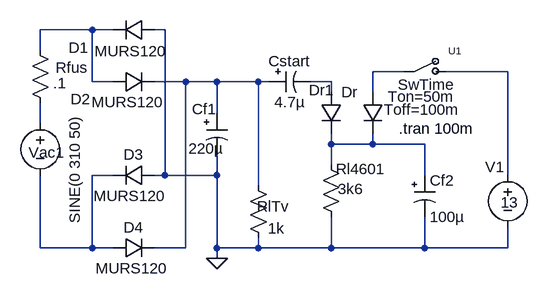
[diagram p0: schematic tda4601_Cstart.asc]
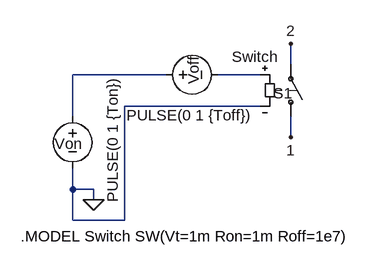
[diagram p1: sub-circuit swtime.asc]
tda4601_Cstart.asc, the LTspice schematic file:
Version 4
SHEET 1 880 680
WIRE -896 -48 -976 -48
WIRE -864 -48 -896 -48
WIRE -784 -48 -800 -48
WIRE -976 -16 -976 -48
WIRE -416 16 -464 16
WIRE -256 16 -352 16
WIRE -896 32 -896 -48
WIRE -864 32 -896 32
WIRE -752 32 -800 32
WIRE -704 32 -752 32
WIRE -640 32 -704 32
WIRE -624 32 -640 32
WIRE -528 32 -560 32
WIRE -528 48 -528 32
WIRE -464 48 -464 16
WIRE -704 80 -704 32
WIRE -976 96 -976 64
WIRE -528 128 -528 112
WIRE -464 128 -464 112
WIRE -464 128 -528 128
WIRE -384 128 -464 128
WIRE -528 160 -528 128
WIRE -864 176 -896 176
WIRE -784 176 -784 -48
WIRE -784 176 -800 176
WIRE -704 176 -704 144
WIRE -704 176 -784 176
WIRE -384 176 -384 128
WIRE -256 176 -256 16
WIRE -640 192 -640 32
WIRE -976 288 -976 176
WIRE -896 288 -896 176
WIRE -896 288 -976 288
WIRE -864 288 -896 288
WIRE -752 288 -752 32
WIRE -752 288 -800 288
WIRE -704 288 -704 176
WIRE -640 288 -640 272
WIRE -640 288 -704 288
WIRE -528 288 -528 240
WIRE -528 288 -640 288
WIRE -384 288 -384 240
WIRE -384 288 -528 288
WIRE -256 288 -256 256
WIRE -256 288 -384 288
WIRE -704 304 -704 288
FLAG -704 304 0
SYMBOL diode -800 -64 R90
WINDOW 0 59 117 VBottom 0
WINDOW 3 33 37 VTop 0
SYMATTR InstName D1
SYMATTR Value MURS120
SYMBOL diode -864 16 M90
WINDOW 0 58 -50 VBottom 0
WINDOW 3 32 23 VTop 0
SYMATTR InstName D2
SYMATTR Value MURS120
SYMBOL diode -800 160 R90
WINDOW 0 0 32 VBottom 0
WINDOW 3 32 38 VTop 0
SYMATTR InstName D3
SYMATTR Value MURS120
SYMBOL diode -864 272 M90
WINDOW 0 0 32 VBottom 0
WINDOW 3 32 29 VTop 0
SYMATTR InstName D4
SYMATTR Value MURS120
SYMBOL voltage -976 80 R0
WINDOW 0 -18 61 Left 0
WINDOW 3 53 4 VRight 0
WINDOW 123 0 0 Left 0
WINDOW 39 24 132 Left 0
SYMATTR InstName Vac1
SYMATTR Value SINE(0 310 50)
SYMBOL res -992 -32 R0
WINDOW 0 40 42 Left 0
WINDOW 3 36 66 Left 0
SYMATTR InstName Rfus
SYMATTR Value .1
SYMATTR SpiceLine tol=1 pwr=0.1
SYMBOL polcap -720 80 R0
WINDOW 3 -28 55 Left 0
WINDOW 0 -22 -6 Left 0
SYMATTR Value 220µ
SYMATTR InstName Cf1
SYMATTR Description Capacitor
SYMATTR Type cap
SYMATTR SpiceLine V=100 Irms=590m Rser=0.1 MTBF=2000 Lser=0 mfg="Nichicon" pn="UPR2A221MRH" type="Al electrolytic" ppPkg=1
SYMBOL res -512 256 R180
WINDOW 0 -68 90 Left 0
WINDOW 3 -33 59 Left 0
SYMATTR InstName Rl4601
SYMATTR Value 3k6
SYMATTR SpiceLine tol=10 pwr=4
SYMBOL diode -480 48 R0
WINDOW 0 -32 0 Left 0
WINDOW 3 -108 57 Invisible 0
SYMATTR InstName Dr
SYMATTR Value MURS120
SYMBOL polcap -400 176 R0
WINDOW 3 24 64 Left 0
SYMATTR Value 100µ
SYMATTR InstName Cf2
SYMATTR Description Capacitor
SYMATTR Type cap
SYMATTR SpiceLine V=16 Irms=1.436 Rser=0.08 Lser=0 mfg="KEMET" pn="T495X107K016AS4823" type="Tantalum"
SYMBOL Robertugo\\SwTime -384 16 R0
SYMATTR SpiceLine Ton=50m
SYMATTR SpiceLine2 Toff=100m
SYMATTR InstName U1
SYMBOL voltage -256 160 R0
WINDOW 0 -35 3 Left 0
WINDOW 3 -11 58 Left 0
SYMATTR InstName V1
SYMATTR Value 13
SYMBOL polcap -624 16 M90
WINDOW 0 0 32 VBottom 0
WINDOW 3 32 32 VTop 0
SYMATTR InstName Cstart
SYMATTR Value 4.7µ
SYMATTR Description Capacitor
SYMATTR Type cap
SYMATTR SpiceLine V=100 Irms=37m Rser=4.6 Lser=0 mfg="Nichicon" pn="UPR2A4R7MAH" type="Al electrolytic"
SYMBOL res -624 288 R180
WINDOW 0 -31 64 Left 0
WINDOW 3 -24 30 Left 0
SYMATTR InstName RlTv
SYMATTR Value 1k
SYMATTR SpiceLine tol=10 pwr=4
SYMBOL diode -544 48 R0
WINDOW 0 -18 -3 Left 0
WINDOW 3 -108 57 Invisible 0
SYMATTR InstName Dr1
SYMATTR Value MURS120
TEXT -424 104 Left 0 !.tran 100m

swtime.asc, the sub-circuit schematic file:
Version 4
SHEET 1 880 1444
WIRE 224 1152 224 1120
WIRE 32 1168 -112 1168
WIRE 176 1168 112 1168
WIRE 176 1216 -32 1216
WIRE -112 1232 -112 1168
WIRE 224 1264 224 1232
WIRE -112 1344 -112 1312
WIRE -80 1344 -112 1344
WIRE -80 1360 -80 1344
WIRE -112 1392 -112 1344
WIRE -32 1392 -32 1216
WIRE -32 1392 -112 1392
FLAG 224 1264 1
FLAG 224 1120 2
FLAG -80 1360 0
SYMBOL voltage -112 1216 R0
WINDOW 3 62 -45 VRight 0
WINDOW 123 0 0 Left 0
WINDOW 39 78 67 Left 0
WINDOW 0 -28 58 Left 0
SYMATTR Value PULSE(0 1 {Ton})
SYMATTR InstName Von
SYMBOL sw 224 1248 M180
WINDOW 0 -27 52 Left 0
WINDOW 3 -91 108 Left 0
SYMATTR InstName S1
SYMATTR Value Switch
SYMBOL voltage 16 1168 M90
WINDOW 3 62 -45 VRight 0
WINDOW 123 0 0 Left 0
WINDOW 39 78 67 Left 0
WINDOW 0 -28 58 Left 0
SYMATTR Value PULSE(0 1 {Toff})
SYMATTR InstName Voff
TEXT -192 1416 Left 0 !.MODEL Switch SW(Vt=1m Ron=1m Roff=1e7)

The netlist it stands for:
* tda4601_Cstart.asc
D1 0 N001 MURS120
D2 N001 N004 MURS120
D3 0 N008 MURS120
D4 N008 N004 MURS120
Vac1 N006 N008 SINE(0 310 50)
Rfus N001 N006 .1 tol=1 pwr=0.1
Cf1 N004 0 220µ V=100 Irms=590m Rser=0.1 MTBF=2000 Lser=0 mfg="Nichicon" pn="UPR2A221MRH" type="Al electrolytic" ppPkg=1
Rl4601 0 N007 3k6 tol=10 pwr=4
Dr N002 N007 MURS120
Cf2 N007 0 100µ V=16 Irms=1.436 Rser=0.08 Lser=0 mfg="KEMET" pn="T495X107K016AS4823" type="Tantalum"
XU1 N002 N003 swtime params: SwTime Ton=50m Toff=100m
V1 N003 0 13
Cstart N004 N005 4.7µ V=100 Irms=37m Rser=4.6 Lser=0 mfg="Nichicon" pn="UPR2A4R7MAH" type="Al electrolytic"
RlTv 0 N004 1k tol=10 pwr=4
Dr1 N005 N007 MURS120

* block symbol definitions
.subckt swtime 1 2
Von N001 0 PULSE(0 1 {Ton})
S1 1 2 N002 0 Switch
Voff N001 N002 PULSE(0 1 {Toff})
.MODEL Switch SW(Vt=1m Ron=1m Roff=1e7)
.ends swtime

.model D D
.lib standard.dio
.tran 100m
.backanno
.end